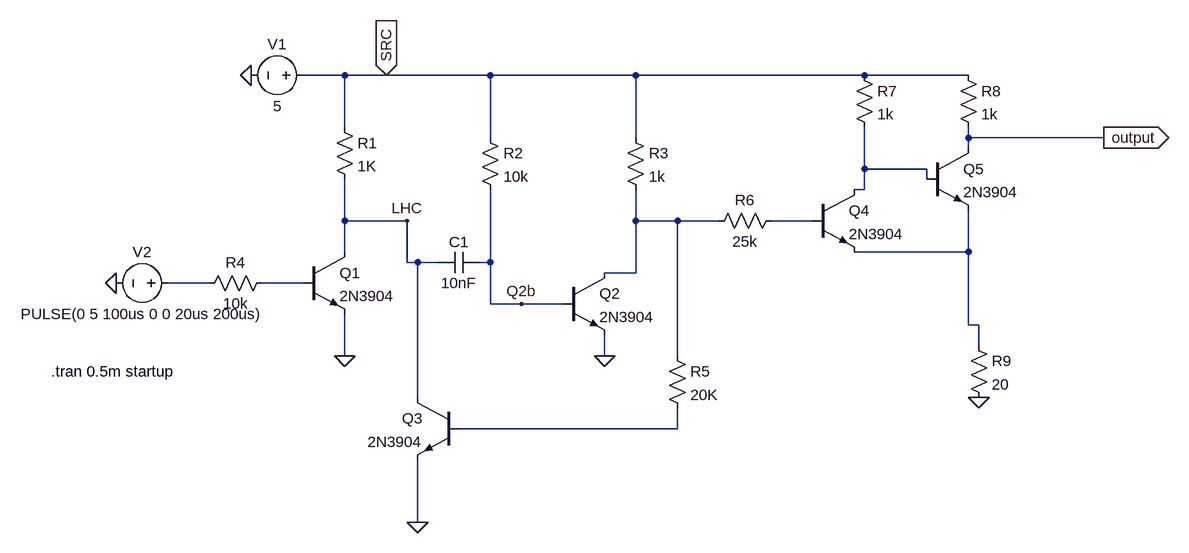
[diagram p0: schematic pulse_generator_III.asc]
pulse_generator_III.asc, the LTspice schematic file:
Version 4
SHEET 1 1576 884
WIRE 272 176 208 176
WIRE 336 176 272 176
WIRE 496 176 336 176
WIRE 720 176 496 176
WIRE 1072 176 720 176
WIRE 1232 176 1072 176
WIRE 272 256 272 176
WIRE 496 272 496 176
WIRE 720 272 720 176
WIRE 1232 272 1232 256
WIRE 1440 272 1232 272
WIRE 1232 288 1232 272
WIRE 1072 320 1072 256
WIRE 1168 320 1072 320
WIRE 1168 336 1168 320
WIRE 1072 352 1072 320
WIRE 1072 352 1056 352
WIRE 272 400 272 336
WIRE 368 400 272 400
WIRE 720 400 720 352
WIRE 784 400 720 400
WIRE 848 400 784 400
WIRE 992 400 928 400
WIRE 272 448 272 400
WIRE 1232 448 1232 384
WIRE 1232 448 1056 448
WIRE 368 464 368 400
WIRE 384 464 368 464
WIRE 416 464 384 464
WIRE 496 464 496 352
WIRE 496 464 480 464
WIRE 720 480 720 400
WIRE 720 480 672 480
WIRE 64 496 0 496
WIRE 208 496 144 496
WIRE 496 528 496 464
WIRE 544 528 496 528
WIRE 608 528 544 528
WIRE 1232 560 1232 448
WIRE 1248 560 1232 560
WIRE 1248 592 1248 560
WIRE 272 608 272 544
WIRE 672 608 672 576
WIRE 784 608 784 400
WIRE 384 672 384 464
WIRE 784 720 784 688
WIRE 784 720 448 720
WIRE 384 864 384 768
FLAG 128 176 0
FLAG 272 608 0
FLAG 672 608 0
FLAG 544 528 Q2b
FLAG 368 400 LHC
FLAG 336 176 SRC
IOPIN 336 176 In
FLAG -80 496 0
FLAG 384 864 0
FLAG 1248 672 0
FLAG 1440 272 output
IOPIN 1440 272 Out
SYMBOL voltage 224 176 R90
WINDOW 0 -32 56 VBottom 2
WINDOW 3 32 56 VTop 2
WINDOW 123 0 0 Left 0
WINDOW 39 0 0 Left 0
SYMATTR InstName V1
SYMATTR Value 5
SYMBOL res 256 240 R0
SYMATTR InstName R1
SYMATTR Value 1K
SYMATTR SpiceLine tol=1 pwr=0.1
SYMBOL res 480 256 R0
SYMATTR InstName R2
SYMATTR Value 10k
SYMBOL res 704 256 R0
SYMATTR InstName R3
SYMATTR Value 1k
SYMBOL res 160 480 R90
WINDOW 0 0 56 VBottom 2
WINDOW 3 32 56 VTop 2
SYMATTR InstName R4
SYMATTR Value 10k
SYMBOL npn 208 448 R0
SYMATTR InstName Q1
SYMATTR Value 2N3904
SYMBOL npn 608 480 R0
SYMATTR InstName Q2
SYMATTR Value 2N3904
SYMBOL cap 480 448 R90
WINDOW 0 0 32 VBottom 2
WINDOW 3 32 32 VTop 2
SYMATTR InstName C1
SYMATTR Value 10nF
SYMBOL voltage 16 496 R90
WINDOW 0 -32 56 VBottom 2
WINDOW 3 32 56 VTop 2
WINDOW 123 0 0 Left 0
WINDOW 39 0 0 Left 0
SYMATTR InstName V2
SYMATTR Value PULSE(0 5 100us 0 0 20us 200us)
SYMBOL npn 448 672 M0
SYMATTR InstName Q3
SYMATTR Value 2N3904
SYMBOL res 768 592 R0
SYMATTR InstName R5
SYMATTR Value 20K
SYMATTR SpiceLine tol=1 pwr=0.1
SYMBOL res 944 384 R90
WINDOW 0 0 56 VBottom 2
WINDOW 3 32 56 VTop 2
SYMATTR InstName R6
SYMATTR Value 25k
SYMBOL res 1056 160 R0
SYMATTR InstName R7
SYMATTR Value 1k
SYMBOL res 1216 160 R0
SYMATTR InstName R8
SYMATTR Value 1k
SYMBOL npn 992 352 R0
SYMATTR InstName Q4
SYMATTR Value 2N3904
SYMBOL npn 1168 288 R0
SYMATTR InstName Q5
SYMATTR Value 2N3904
SYMBOL res 1232 576 R0
SYMATTR InstName R9
SYMATTR Value 20
TEXT -180 632 Left 2 !.tran 0.5m startup

The netlist it stands for:
* pulse_generator_III.asc
V1 SRC 0 5
R1 SRC LHC 1K tol=1 pwr=0.1
R2 SRC Q2b 10k
R3 SRC N002 1k
R4 N006 N005 10k
Q1 LHC N006 0 0 2N3904
Q2 N002 Q2b 0 0 2N3904
C1 Q2b LHC 10nF
V2 N005 0 PULSE(0 5 100us 0 0 20us 200us)
Q3 LHC N007 0 0 2N3904
R5 N002 N007 20K tol=1 pwr=0.1
R6 N003 N002 25k
R7 SRC N001 1k
R8 SRC output 1k
Q4 N001 N003 N004 0 2N3904
Q5 output N001 N004 0 2N3904
R9 N004 0 20
.model NPN NPN
.model PNP PNP
.lib standard.bjt
.tran 0.5m startup
.backanno
.end